# Altium schematic sheet PG12_ SATA _ SDIO.SchDoc
size 420 x 297 mm
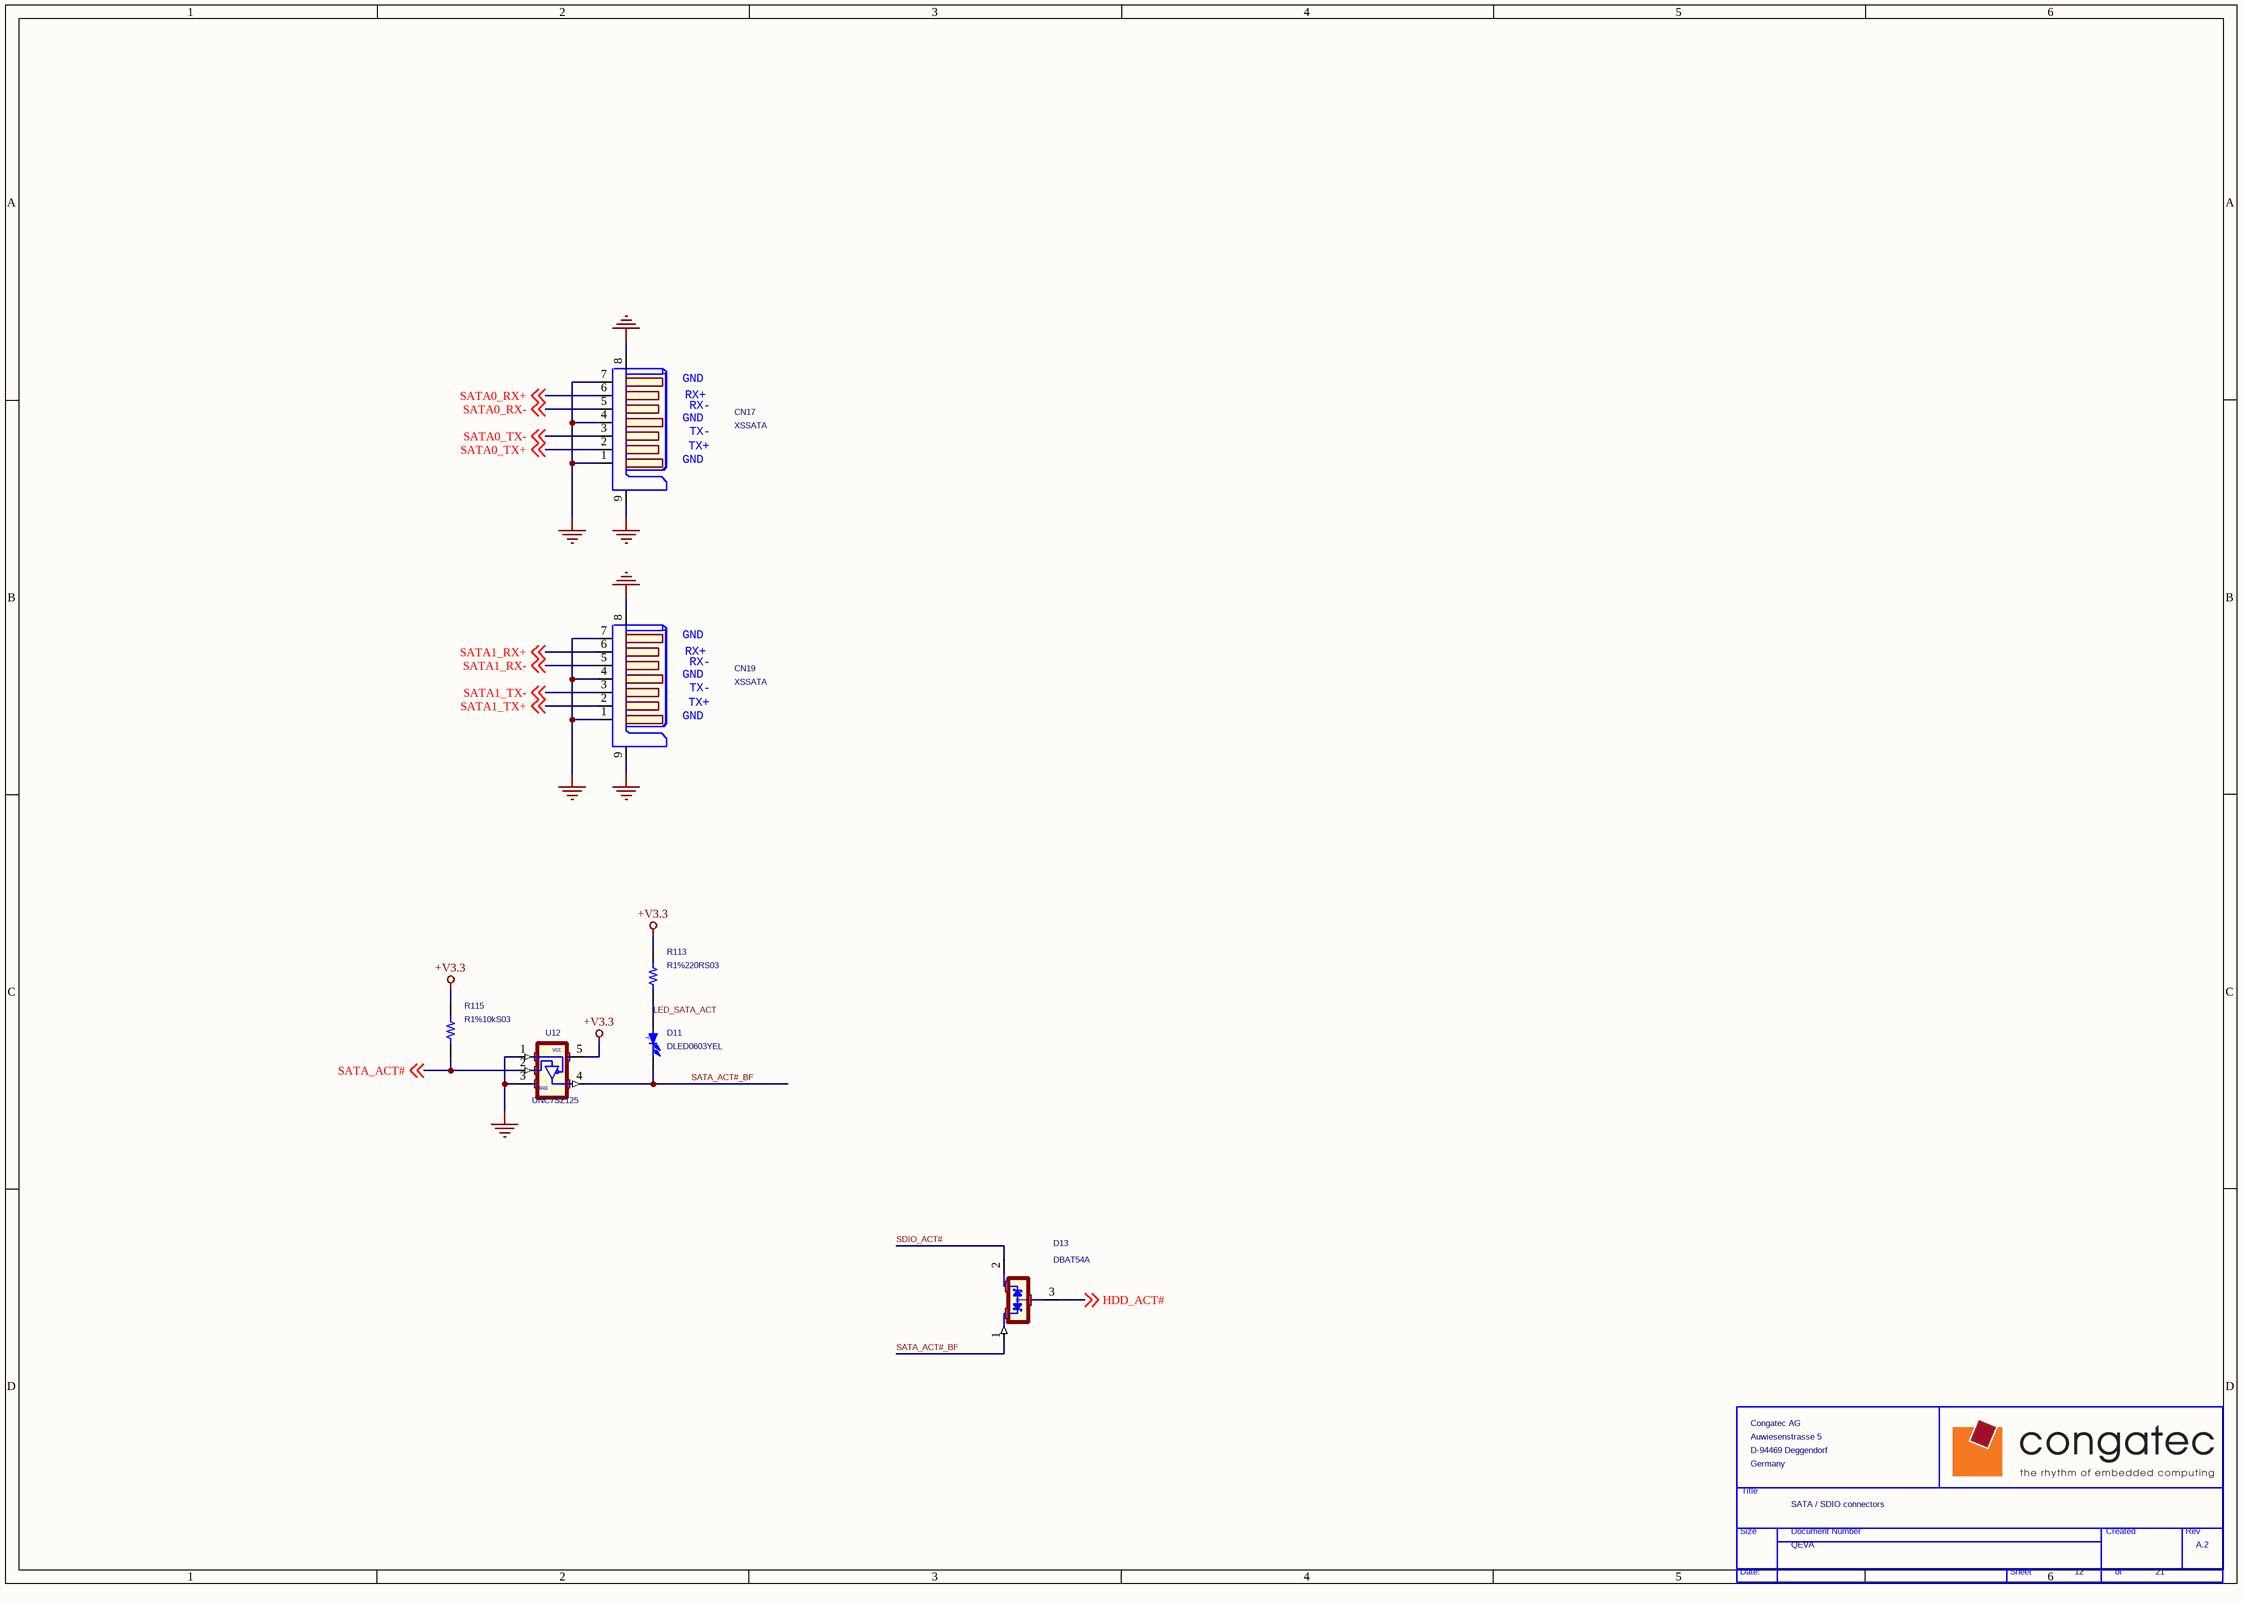
[diagram p0: PG12_ SATA _ SDIO.SchDoc]

## Parts
*  Page Count: 21  Page Number: 12  Title: SATA / SDIO connectors  RevCode: A.2  Doc: QEVA  OrgName: Congatec AG  OrgAddr1: Auwiesenstrasse 5  OrgAddr2: D-94469 Deggendorf  OrgAddr3: Germany  (hidden comment: TitleBlock_CONGA)  (graphical)
CN17  XSSATA  [SATA]
CN19  XSSATA  [SATA]
D11  DLED0603YEL  [LED-0603]
D13  DBAT54A  [SOT-23A]
R113  R1%220RS03  [R0603]
R115  R1%10kS03  [R0603]
U12  UNC7SZ125  [SOT-23-5]

## Nets
+V3.3: R113.1 R115.1 U12.5
GND: CN17.1(GND_1) CN17.4(GND_2) CN17.7(GND_3) CN17.8 CN17.9 CN19.1(GND_1) CN19.4(GND_2) CN19.7(GND_3) CN19.8 CN19.9 U12.1(OE) U12.3
HDD_ACT#: D13.3(ANODE) ; off-sheet HDD_ACT#
LED_SATA_ACT: D11.1(ANODE) R113.2
SATA0_RX+: CN17.6(RX+) ; off-sheet SATA0_RX+
SATA0_RX-: CN17.5(RX-) ; off-sheet SATA0_RX-
SATA0_TX+: CN17.2(TX+) ; off-sheet SATA0_TX+
SATA0_TX-: CN17.3(TX-) ; off-sheet SATA0_TX-
SATA1_RX+: CN19.6(RX+) ; off-sheet SATA1_RX+
SATA1_RX-: CN19.5(RX-) ; off-sheet SATA1_RX-
SATA1_TX+: CN19.2(TX+) ; off-sheet SATA1_TX+
SATA1_TX-: CN19.3(TX-) ; off-sheet SATA1_TX-
SATA_ACT#: R115.2 U12.2(A) ; off-sheet SATA_ACT#
SATA_ACT#_BF: D11.2(CATHODE) D13.1(CATHODE_1) U12.4(B)
SDIO_ACT#: D13.2(CATHODE_2)

## Notes on the sheet
- (in symbol 14S_NC7SZ125M5X_SOT-23-5_0) VCC; GND
- (in symbol 130_LED_LED-0603_Y_0) Y
- (in symbol 1654_SATA_0) GND
- (in symbol TitleBlock_CONGA) Title; Size; Document Number; Created; Rev; Date:; Sheet; of

## Library data of the parts
CN17 CN19 = 1654_SATA_0: Serial ATA 7P 180D(M) DIP 1.27mm WO/Pb; Part_Number: 41500327; Part Number: 1654001158; Manufacture Part Number: WATM-07DBLB2D8UW; BOM_Level: 1; Revision: A; Package: SATA7P; ProcessType: DIP
D11 = 130_LED_LED-0603_Y_0: LED YELLOW SMD 2P 0603 LYQ971 OSRAM; Part_Number: 44500018; Part Number: 1304000017; Manufacture: (DEL)?????????; Manufacture(English): DEL; BOM_Level: 1; ProcessType: SMT; Revision: A; Package: 0603; Manufacture Part Number: LY Q971
D13 = 130_Schottky_SOT-23A_CA_1_Dup1: *DIODE SOT23 BAT54A double Schottky COMMON ANODE; Part_Number: 42500001; Part Number: 1301005440; BOM_Level: 1; ProcessType: SMT; Revision: A; Manufacture Part Number: BAT54A; Package: SOT-23
R113 = 10_R_0_Dup1: 220 1/10W 5% 0603 CR WO/Pb; Part Number: 105A722009; Manufacture Part Number: 0603WAJ0221T5E試232270260221L試RM06JTN221; Part_Number: 45502013; ProcessType: SMT; BOM_Level: 1; Tolerance: 5%; Package: 0603; Revision: A
R115 = 10_R_0_Dup1: R 10K 1/10W 1% SMD 0603 CR WO/Pb; Part Number: 105A510023; Manufacture Part Number: RCT02***FTP試0603WAF1002T5E試2322 704 61003L試RC0603FR-0710KL試RM06FTN1002試WR06X8200JT; Part_Number: 45502052; ProcessType: SMT; BOM_Level: 1; Tolerance: 1%; Package: 0603; Revision: A
U12 = 14S_NC7SZ125M5X_SOT-23-5_0: IC SMD NC7SZ125M5X SOT23-5P; Part_Number: 43000017; Part Number: 14S5A12530; BOM_Level: 1; ProcessType: SMT; Revision: A; Package: SOT-23-5; Manufacture Part Number: NC7SZ125M5X
* = TitleBlock_CONGA: Page Create Date: March  8, 1995